# Altium schematic sheet Misc.SchDoc: Misc
size A4; ApprovedBy: Self; CheckedBy: Self; CompanyName: TAISAT; DrawnBy: Alperen FENERCİ; Organization: IKA; SheetNumber: 5; SheetTotal: 6
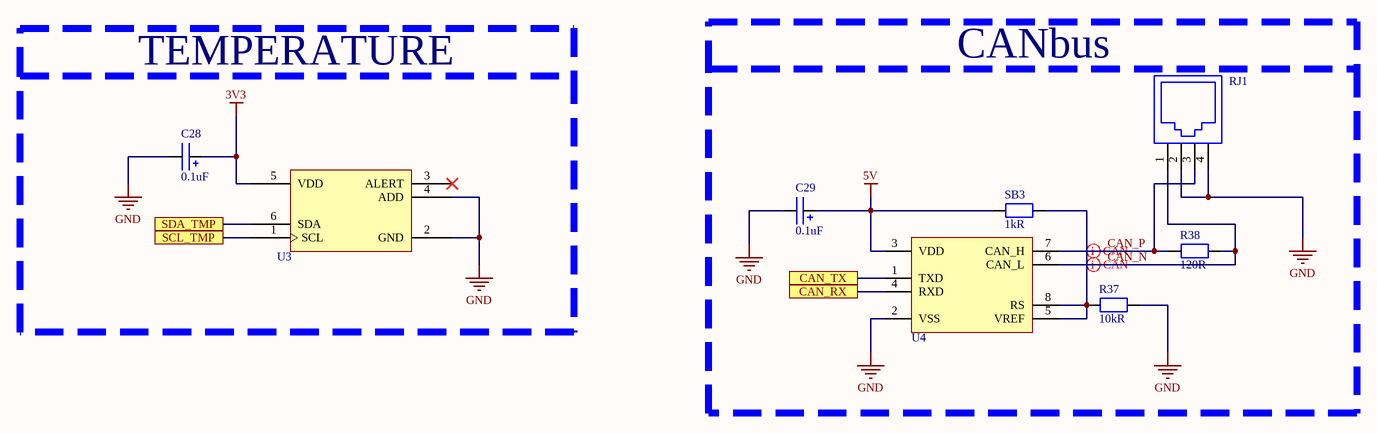
[diagram p0: Misc.SchDoc]

## Parts
C28  value 0.1uF  [CAP 0603]  (hidden comment: CAP 0603)
C29  value 0.1uF  [CAP 0603]  (hidden comment: CAP 0603)
R37  value 10kR  [RESISTOR 0603]  (hidden comment: RES 0603)
R38  value 120R  [RESISTOR 0603]  (hidden comment: RES 0603)
RJ1  DS1133-03-S60BX  [RJ6P4C]  (value not drawn)
SB3  value 1kR  [RESISTOR 0603]  (hidden comment: RES 0603)
U3  TMP112AIDRLT  [SOT563]  (value not drawn)
U4  MCP2551T-I  [SOIC-8]  (value not drawn)

## Blocks framed on the sheet
TEMPERATURE: C28 U3
CANbus: C29 R37 R38 RJ1 SB3 U4

## Ports
CAN_RX, CAN_TX, SCL_TMP, SDA_TMP

## Nets
3V3: C28.1 U3.5(VDD)
5V: C29.1 SB3.2 U4.3(VDD)
GND: C28.2 C29.2 R37.1 RJ1.2 RJ1.4 U3.2(GND) U3.4(ADD) U4.2(VSS)
CAN_N: R38.2 RJ1.1 U4.6(CAN_L)
CAN_P: R38.1 RJ1.3 U4.7(CAN_H)
CAN_RX: U4.4(RXD) ; port CAN_RX
CAN_TX: U4.1(TXD) ; port CAN_TX
SCL_TMP: U3.1(SCL) ; port SCL_TMP
SDA_TMP: U3.6(SDA) ; port SDA_TMP
NetR37_2: R37.2 SB3.1 U4.5(VREF) U4.8(RS)

Not connected (* = marked no-connect by the designer): U3 3(ALERT)*

## Layout directives
differential pair: CAN_N, CAN_P

## Notes on the sheet
- Dosya Adı / File Name
- Proje Adı / Project Name
- Sayfa Adı / Sheet Name
- Şirket Adı / Company Name
- Tasarlayan / Designed By
- Takım / Team
- Kontrol Eden / Checked By
- Başlangıç Tarihi / Start Date
- Revize Tarihi / Revision Date
- Onaylayan / Approved By
- Sayfa / Sheet

## Library data of the parts
C28 C29 = CAP 0603: Multilayer Ceramic Capacitor; Capacitor Type: MLCC; Case/Package: 0603
R37 R38 SB3 = RES 0603: SMD Chip Resistor; Case/Package: 0603
RJ1 = RJ11: RJ11 Jack; Positions/Contacts: 6P/4C; RJ Type: RJ11
U3 = TMP112AIDRLT: Temp Sensor; Category: Sensor; Package/Case: SOT563
U4 = MCP2551T-I: CAN Transceiver; Category: Interface IC; Case/Package: SOIC-8